# Altium schematic sheet Sheet2.SchDoc
size A4; DocumentNumber: 3; SheetNumber: 3; SheetTotal: 3
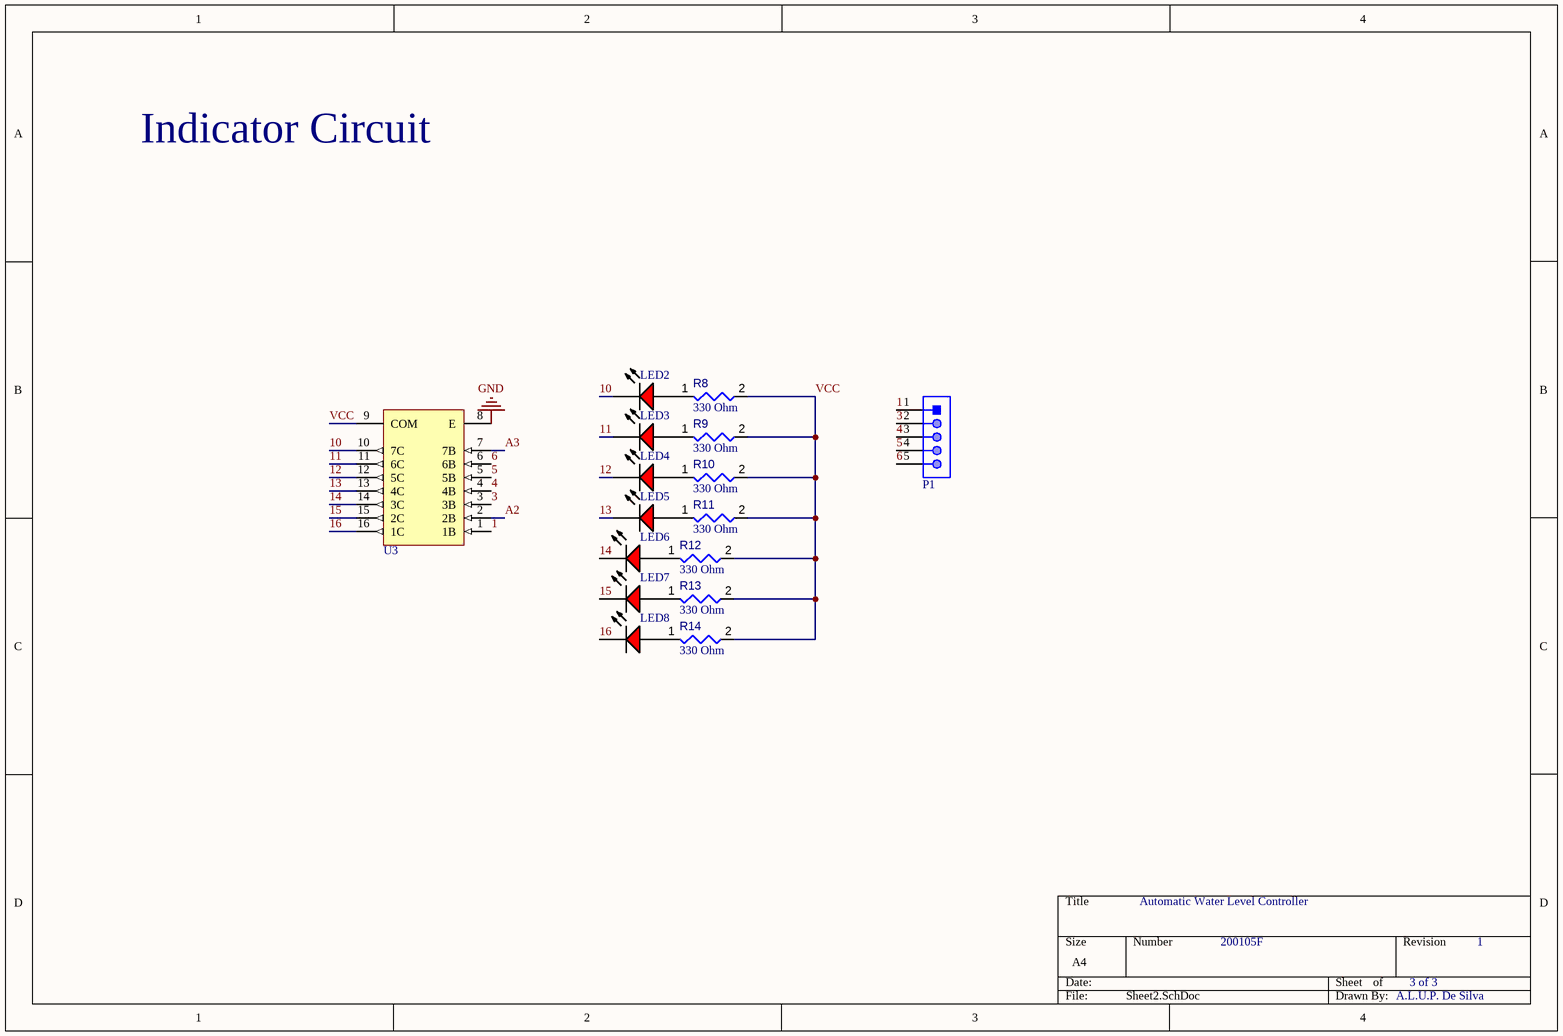
[diagram p0: Sheet2.SchDoc]

## Parts
LED2  HLMP-3301  [AVAG-HLMP-3301-2]  (value not drawn)
LED3  HLMP-3301  [AVAG-HLMP-3301-2]  (value not drawn)
LED4  HLMP-3301  [AVAG-HLMP-3301-2]  (value not drawn)
LED5  HLMP-3301  [AVAG-HLMP-3301-2]  (value not drawn)
LED6  HLMP-3301  [AVAG-HLMP-3301-2]  (value not drawn)
LED7  HLMP-3301  [AVAG-HLMP-3301-2]  (value not drawn)
LED8  HLMP-3301  [AVAG-HLMP-3301-2]  (value not drawn)
P1  691311700105  [691311700105]  (value not drawn)
R8  value 330 Ohm  [RESA60-630X240]  (hidden comment: MFR-25FBF52-475K)
R9  value 330 Ohm  [RESA60-630X240]  (hidden comment: MFR-25FBF52-475K)
R10  value 330 Ohm  [RESA60-630X240]  (hidden comment: MFR-25FBF52-475K)
R11  value 330 Ohm  [RESA60-630X240]  (hidden comment: MFR-25FBF52-475K)
R12  value 330 Ohm  [RESA60-630X240]  (hidden comment: MFR-25FBF52-475K)
R13  value 330 Ohm  [RESA60-630X240]  (hidden comment: MFR-25FBF52-475K)
R14  value 330 Ohm  [RESA60-630X240]  (hidden comment: MFR-25FBF52-475K)
U3  ULN2003AN  [N0016A]  (value not drawn)

## Nets
GND: U3.8(E)
1: P1.1 U3.1(1B)
3: P1.2 U3.3(3B)
4: P1.3 U3.4(4B)
5: P1.4 U3.5(5B)
6: P1.5 U3.6(6B)
10: LED2.1(K) U3.10(7C)
11: LED3.1(K) U3.11(6C)
12: LED4.1(K) U3.12(5C)
13: LED5.1(K) U3.13(4C)
14: LED6.1(K) U3.14(3C)
15: LED7.1(K) U3.15(2C)
16: LED8.1(K) U3.16(1C)
A2: U3.2(2B)
A3: U3.7(7B)
VCC: R8.2 R9.2 R10.2 R11.2 R12.2 R13.2 R14.2 U3.9(COM)
NetLED2_2: LED2.2(A) R8.1
NetLED3_2: LED3.2(A) R9.1
NetLED4_2: LED4.2(A) R10.1
NetLED5_2: LED5.2(A) R11.1
NetLED6_2: LED6.2(A) R12.1
NetLED7_2: LED7.2(A) R13.1
NetLED8_2: LED8.2(A) R14.1

## Notes on the sheet
- Indicator Circuit
- Automatic Water Level Controller
- 200105F
- 3 of 3
- 1
- A.L.U.P. De Silva

## Library data of the parts
LED2-LED8 = CMP-2000-06411-1: T-1 3/4 (5 mm) Diffused LED Lamp, 1.9 V, -40 to 100 degC, 2-Pin THD, RoHS, Bulk; Manufacturer: Avago; Forward Current: 25mA; Forward Voltage: 2.4V; Peak Wavelength: 635nm; Shape Type: Circular; High Brightness: No; Main Category: StandardLED; Test Current (It): 10mA; Dominant Wave Length: 626nm; Number of  Elements: 1; Reverse Voltage: 5V; Chip Material: GaP; Product Height (mm): 9.19mm; Lens Type: ColoredDiffused; Viewing Angle: 60deg; Type: Uni-Color; Emitting Color: Red; Luminous Intensity: 5.4mcd; Power Dissipation: 85W; DELETED: Compliant; Product Depth (mm): 6.1mm; Package Description: 2-Pin Through Hole LED, Dia 5.85 mm; Mounting Technology: ThroughHole; Manufacturer URL: http://www.avagotech.com/; Package Type: T-13/4; Operating Temp Range: -40Cto100C; Datasheet URL: http://www.avagotech.com/docs/AV02-1558EN; Mounting: ThroughHole; Lens Dimensions: 5.08x5.08x8.3mm; Package Reference: HLMP-3301; Datasheet Version: 03/2015; Pin Count: 2; Packaging: TapeandReel; Operating Temperature Classification: Industrial; Lum Intensity: 5.4mcd; Rad Hardened: No; Product Length (mm): 6.1mm
P1 = CMP-1502-02036-1: Serie 3117 - 5.00mm Close Vertical PCB Header WR-TBL, 5 pin; Manufacturer: Wurth Elektronik; Pin Number: 5; Gender: Male; Operating Temperature: -40to105degC; Package Reference: 691311700105; Pitch: 5.00mm; Datasheet URL: http://katalog.we-online.de/em/datasheet/6913117001xx.pdf; Part Number: 691311700105; Publisher: WurthElektronik; Manufacturer URL: http://www.we-online.de; Packaging: Box; Mounting Technology: THT
R8-R14 = CMP-009-00055-4: Axial Resistor, 475 KOhm, +/- 1%, 0.25 W, -55 to 155 degC, 2-Pin THD, RoHS, Bulk; Manufacturer: Yageo; Power: 250mW; Voltage Rating: 250V; Case/Package: Axial; Mounting Technology: TH; RoHS Compliant: True; Package Description: 2-Pin Axial Lead, Dia 2.4 mm, Body Length 6.3 mm; Min Operating Temperature: -55°C; Datasheet URL: http://www.yageo.com/documents/recent/Yageo%20LR_MFR_2013.pdf; Manufacturer URL: http://www.yageo.com/; Package Quantity: 200; Package Reference: MFR-25; Max Operating Temperature: 155°C; Datasheet Version: Apr-13; Tolerance: 1%; Packaging: Bulk
U3 = CMP-2000-07352-1: High-Voltage, High-Current Darlington Transistor Array, 50 V, 500 mA, -20 to 70 degC, 16-Pin PDIP (N), Pb-Free (RoHS), Tube; Manufacturer: TexasInstruments; Maximum Collector Emitter Saturation Voltage: 1.1@100mA; Peak DC Collector Current: 0.5A; Package Version: 4040049/E, 12/2002; Configuration: Array7; Maximum Collector Emitter Voltage: 50V; Rad Hard: No; Mounting: ThroughHole; Datasheet URL: http://www.ti.com/general/docs/lit/getliterature.tsp?genericPartNumber=uln2003a&fileType=pdf; Package: 16PDIP; Package Reference: N16; Datasheet Version: Rev. O, 01/2016; Mounting Technology: ThroughHole; Package Description: 16-Pin Plastic In-Line, Body 19.305 x 6.35 mm, Pitch 2.54 mm; Manufacturer URL: http://www.ti.com/; Type: NPN; Category: DarlingtonBJT; Package URL: http://www.ti.com/litv/pdf/mpdi002c; Packaging: Rail/Tube